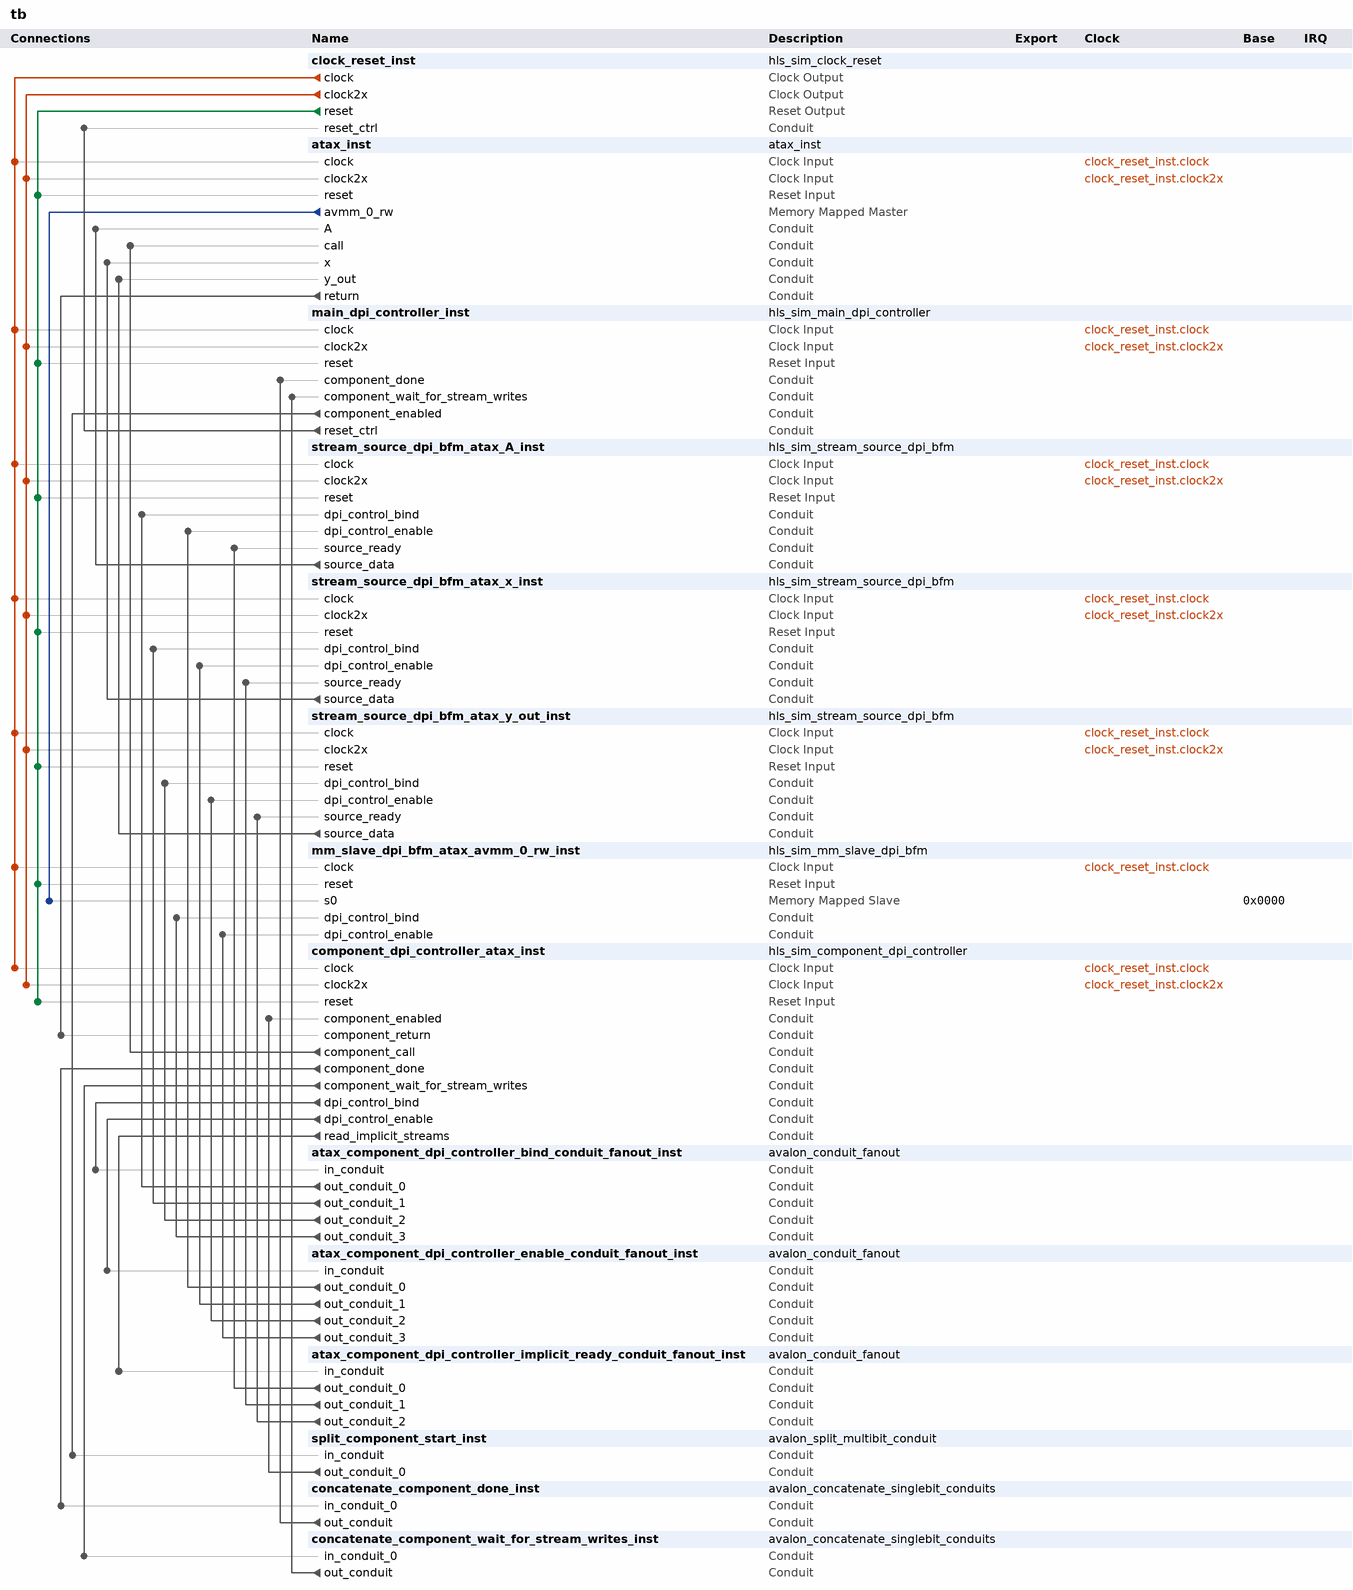
[diagram p0: system contents]
# Platform Designer (Qsys) system tb, Agilex AGFA012R24A1E1V
# Parameters at their usual value, and those the tool derives, are not listed.
package require -exact qsys 1.0
create_system tb
set_project_property DEVICE_FAMILY Agilex
set_project_property DEVICE AGFA012R24A1E1V

add_component clock_reset_inst ip/tb/clock_reset.ip hls_sim_clock_reset clock_reset_inst 1.0
load_component clock_reset_inst
set_component_parameter_value RESET_CYCLE_HOLD 4
save_component

add_component atax_inst ../components/atax/atax.ip atax_inst atax_inst 1.0

add_component main_dpi_controller_inst ip/tb/main_dpi_controller.ip hls_sim_main_dpi_controller main_dpi_controller_inst 1.0
load_component main_dpi_controller_inst
set_component_parameter_value NUM_COMPONENTS 1
set_component_parameter_value COMPONENT_NAMES_STR atax
save_component

add_component stream_source_dpi_bfm_atax_A_inst ip/tb/sso_atax_A.ip hls_sim_stream_source_dpi_bfm stream_source_dpi_bfm_atax_A_inst 1.0
load_component stream_source_dpi_bfm_atax_A_inst
set_component_parameter_value COMPONENT_NAME atax
set_component_parameter_value INTERFACE_NAME A
set_component_parameter_value STREAM_DATAWIDTH 64
set_component_parameter_value FORCE_STREAM_CONDUIT 1
set_component_parameter_value STREAM_BITSPERSYMBOL 1
set_component_parameter_value USES_PACKETS 0
set_component_parameter_value EMPTY_WIDTH 0
set_component_parameter_value FIRST_SYMBOL_IN_HIGH_ORDER_BITS 0
save_component

add_component stream_source_dpi_bfm_atax_x_inst ip/tb/sso_atax_x.ip hls_sim_stream_source_dpi_bfm stream_source_dpi_bfm_atax_x_inst 1.0
load_component stream_source_dpi_bfm_atax_x_inst
set_component_parameter_value COMPONENT_NAME atax
set_component_parameter_value INTERFACE_NAME x
set_component_parameter_value STREAM_DATAWIDTH 64
set_component_parameter_value FORCE_STREAM_CONDUIT 1
set_component_parameter_value STREAM_BITSPERSYMBOL 1
set_component_parameter_value USES_PACKETS 0
set_component_parameter_value EMPTY_WIDTH 0
set_component_parameter_value FIRST_SYMBOL_IN_HIGH_ORDER_BITS 0
save_component

add_component stream_source_dpi_bfm_atax_y_out_inst ip/tb/sso_atax_y_out.ip hls_sim_stream_source_dpi_bfm stream_source_dpi_bfm_atax_y_out_inst 1.0
load_component stream_source_dpi_bfm_atax_y_out_inst
set_component_parameter_value COMPONENT_NAME atax
set_component_parameter_value INTERFACE_NAME y_out
set_component_parameter_value STREAM_DATAWIDTH 64
set_component_parameter_value FORCE_STREAM_CONDUIT 1
set_component_parameter_value STREAM_BITSPERSYMBOL 1
set_component_parameter_value USES_PACKETS 0
set_component_parameter_value EMPTY_WIDTH 0
set_component_parameter_value FIRST_SYMBOL_IN_HIGH_ORDER_BITS 0
save_component

add_component mm_slave_dpi_bfm_atax_avmm_0_rw_inst ip/tb/mm_slave_atax_avmm_0_rw.ip hls_sim_mm_slave_dpi_bfm mm_slave_dpi_bfm_atax_avmm_0_rw_inst 1.0
load_component mm_slave_dpi_bfm_atax_avmm_0_rw_inst
set_component_parameter_value AV_ADDRESS_W 64
set_component_parameter_value AV_SYMBOL_W 8
set_component_parameter_value AV_NUMSYMBOLS 8
set_component_parameter_value AV_BURSTCOUNT_W 3
set_component_parameter_value AV_READRESPONSE_W 8
set_component_parameter_value AV_WRITERESPONSE_W 8
set_component_parameter_value USE_READ 1
set_component_parameter_value USE_WRITE 1
set_component_parameter_value USE_ADDRESS 1
set_component_parameter_value USE_BYTE_ENABLE 1
set_component_parameter_value USE_BURSTCOUNT 0
set_component_parameter_value USE_READ_DATA 1
set_component_parameter_value USE_READ_DATA_VALID 0
set_component_parameter_value USE_WRITE_DATA 1
set_component_parameter_value USE_BEGIN_TRANSFER 0
set_component_parameter_value USE_BEGIN_BURST_TRANSFER 0
set_component_parameter_value USE_ARBITERLOCK 0
set_component_parameter_value USE_LOCK 0
set_component_parameter_value USE_DEBUGACCESS 0
set_component_parameter_value USE_WAIT_REQUEST 0
set_component_parameter_value USE_CLKEN 0
set_component_parameter_value ASSERT_HIGH_WAITREQUEST 1
set_component_parameter_value ASSERT_HIGH_READ 1
set_component_parameter_value ASSERT_HIGH_WRITE 1
set_component_parameter_value ASSERT_HIGH_BYTEENABLE 1
set_component_parameter_value ASSERT_HIGH_READDATAVALID 1
set_component_parameter_value ASSERT_HIGH_ARBITERLOCK 1
set_component_parameter_value ASSERT_HIGH_LOCK 1
set_component_parameter_value AV_BURST_LINEWRAP 1
set_component_parameter_value AV_BURST_BNDR_ONLY 1
set_component_parameter_value AV_MAX_PENDING_READS 0
set_component_parameter_value AV_MAX_PENDING_WRITES 0
set_component_parameter_value AV_FIX_READ_LATENCY 1
set_component_parameter_value AV_READ_WAIT_TIME 0
set_component_parameter_value AV_WRITE_WAIT_TIME 0
set_component_parameter_value REGISTER_WAITREQUEST 0
set_component_parameter_value AV_REGISTERINCOMINGSIGNALS 0
set_component_parameter_value ADDRESS_UNITS SYMBOLS
set_component_parameter_value COMPONENT_NAME atax
set_component_parameter_value INTERFACE_ID 0
save_component

add_component component_dpi_controller_atax_inst ip/tb/dpic_atax.ip hls_sim_component_dpi_controller component_dpi_controller_atax_inst 1.0
load_component component_dpi_controller_atax_inst
set_component_parameter_value COMPONENT_NAME atax
set_component_parameter_value COMPONENT_MANGLED_NAME _Z4ataxPA64_fPfS1_
set_component_parameter_value RETURN_DATAWIDTH 64
set_component_parameter_value COMPONENT_NUM_SLAVES 0
set_component_parameter_value COMPONENT_HAS_SLAVE_RETURN 0
set_component_parameter_value COMPONENT_NUM_OUTPUT_STREAMS 0
save_component

add_component atax_component_dpi_controller_bind_conduit_fanout_inst ip/tb/atax_cfan.ip avalon_conduit_fanout atax_component_dpi_controller_bind_conduit_fanout_inst 1.0
load_component atax_component_dpi_controller_bind_conduit_fanout_inst
set_component_parameter_value numFanOut 4
save_component

add_component atax_component_dpi_controller_enable_conduit_fanout_inst ip/tb/atax_en_cfan.ip avalon_conduit_fanout atax_component_dpi_controller_enable_conduit_fanout_inst 1.0
load_component atax_component_dpi_controller_enable_conduit_fanout_inst
set_component_parameter_value numFanOut 4
save_component

add_component atax_component_dpi_controller_implicit_ready_conduit_fanout_inst ip/tb/atax_ir_cfan.ip avalon_conduit_fanout atax_component_dpi_controller_implicit_ready_conduit_fanout_inst 1.0
load_component atax_component_dpi_controller_implicit_ready_conduit_fanout_inst
set_component_parameter_value numFanOut 3
save_component

add_component split_component_start_inst ip/tb/sp_cstart.ip avalon_split_multibit_conduit split_component_start_inst 1.0
load_component split_component_start_inst
set_component_parameter_value multibit_width 1
save_component

add_component concatenate_component_done_inst ip/tb/cat_done.ip avalon_concatenate_singlebit_conduits concatenate_component_done_inst 1.0
load_component concatenate_component_done_inst
set_component_parameter_value multibit_width 1
save_component

add_component concatenate_component_wait_for_stream_writes_inst ip/tb/cat_cwfsw.ip avalon_concatenate_singlebit_conduits concatenate_component_wait_for_stream_writes_inst 1.0
load_component concatenate_component_wait_for_stream_writes_inst
set_component_parameter_value multibit_width 1
save_component

# connections
add_connection clock_reset_inst.clock atax_inst.clock clock
add_connection clock_reset_inst.clock component_dpi_controller_atax_inst.clock clock
add_connection clock_reset_inst.clock main_dpi_controller_inst.clock clock
add_connection clock_reset_inst.clock mm_slave_dpi_bfm_atax_avmm_0_rw_inst.clock clock
add_connection clock_reset_inst.clock stream_source_dpi_bfm_atax_A_inst.clock clock
add_connection clock_reset_inst.clock stream_source_dpi_bfm_atax_x_inst.clock clock
add_connection clock_reset_inst.clock stream_source_dpi_bfm_atax_y_out_inst.clock clock
add_connection clock_reset_inst.clock2x atax_inst.clock2x clock
add_connection clock_reset_inst.clock2x component_dpi_controller_atax_inst.clock2x clock
add_connection clock_reset_inst.clock2x main_dpi_controller_inst.clock2x clock
add_connection clock_reset_inst.clock2x stream_source_dpi_bfm_atax_A_inst.clock2x clock
add_connection clock_reset_inst.clock2x stream_source_dpi_bfm_atax_x_inst.clock2x clock
add_connection clock_reset_inst.clock2x stream_source_dpi_bfm_atax_y_out_inst.clock2x clock
add_connection clock_reset_inst.reset atax_inst.reset reset
add_connection clock_reset_inst.reset component_dpi_controller_atax_inst.reset reset
add_connection clock_reset_inst.reset main_dpi_controller_inst.reset reset
add_connection clock_reset_inst.reset mm_slave_dpi_bfm_atax_avmm_0_rw_inst.reset reset
add_connection clock_reset_inst.reset stream_source_dpi_bfm_atax_A_inst.reset reset
add_connection clock_reset_inst.reset stream_source_dpi_bfm_atax_x_inst.reset reset
add_connection clock_reset_inst.reset stream_source_dpi_bfm_atax_y_out_inst.reset reset
add_connection atax_inst.avmm_0_rw mm_slave_dpi_bfm_atax_avmm_0_rw_inst.s0 avalon
set_connection_parameter_value atax_inst.avmm_0_rw/mm_slave_dpi_bfm_atax_avmm_0_rw_inst.s0 baseAddress 0x0000
add_connection atax_component_dpi_controller_bind_conduit_fanout_inst.out_conduit_0 stream_source_dpi_bfm_atax_A_inst.dpi_control_bind conduit
add_connection atax_component_dpi_controller_bind_conduit_fanout_inst.out_conduit_1 stream_source_dpi_bfm_atax_x_inst.dpi_control_bind conduit
add_connection atax_component_dpi_controller_bind_conduit_fanout_inst.out_conduit_2 stream_source_dpi_bfm_atax_y_out_inst.dpi_control_bind conduit
add_connection atax_component_dpi_controller_bind_conduit_fanout_inst.out_conduit_3 mm_slave_dpi_bfm_atax_avmm_0_rw_inst.dpi_control_bind conduit
add_connection atax_component_dpi_controller_enable_conduit_fanout_inst.out_conduit_0 stream_source_dpi_bfm_atax_A_inst.dpi_control_enable conduit
add_connection atax_component_dpi_controller_enable_conduit_fanout_inst.out_conduit_1 stream_source_dpi_bfm_atax_x_inst.dpi_control_enable conduit
add_connection atax_component_dpi_controller_enable_conduit_fanout_inst.out_conduit_2 stream_source_dpi_bfm_atax_y_out_inst.dpi_control_enable conduit
add_connection atax_component_dpi_controller_enable_conduit_fanout_inst.out_conduit_3 mm_slave_dpi_bfm_atax_avmm_0_rw_inst.dpi_control_enable conduit
add_connection atax_component_dpi_controller_implicit_ready_conduit_fanout_inst.out_conduit_0 stream_source_dpi_bfm_atax_A_inst.source_ready conduit
add_connection atax_component_dpi_controller_implicit_ready_conduit_fanout_inst.out_conduit_1 stream_source_dpi_bfm_atax_x_inst.source_ready conduit
add_connection atax_component_dpi_controller_implicit_ready_conduit_fanout_inst.out_conduit_2 stream_source_dpi_bfm_atax_y_out_inst.source_ready conduit
add_connection atax_inst.return component_dpi_controller_atax_inst.component_return conduit
add_connection component_dpi_controller_atax_inst.component_call atax_inst.call conduit
add_connection component_dpi_controller_atax_inst.component_done concatenate_component_done_inst.in_conduit_0 conduit
add_connection component_dpi_controller_atax_inst.component_wait_for_stream_writes concatenate_component_wait_for_stream_writes_inst.in_conduit_0 conduit
add_connection component_dpi_controller_atax_inst.dpi_control_bind atax_component_dpi_controller_bind_conduit_fanout_inst.in_conduit conduit
add_connection component_dpi_controller_atax_inst.dpi_control_enable atax_component_dpi_controller_enable_conduit_fanout_inst.in_conduit conduit
add_connection component_dpi_controller_atax_inst.read_implicit_streams atax_component_dpi_controller_implicit_ready_conduit_fanout_inst.in_conduit conduit
add_connection concatenate_component_done_inst.out_conduit main_dpi_controller_inst.component_done conduit
add_connection concatenate_component_wait_for_stream_writes_inst.out_conduit main_dpi_controller_inst.component_wait_for_stream_writes conduit
add_connection main_dpi_controller_inst.component_enabled split_component_start_inst.in_conduit conduit
add_connection main_dpi_controller_inst.reset_ctrl clock_reset_inst.reset_ctrl conduit
add_connection split_component_start_inst.out_conduit_0 component_dpi_controller_atax_inst.component_enabled conduit
add_connection stream_source_dpi_bfm_atax_A_inst.source_data atax_inst.A conduit
add_connection stream_source_dpi_bfm_atax_x_inst.source_data atax_inst.x conduit
add_connection stream_source_dpi_bfm_atax_y_out_inst.source_data atax_inst.y_out conduit

save_system tb.qsys
